# EAGLE design shiftregister (EAGLE 7.2.0)
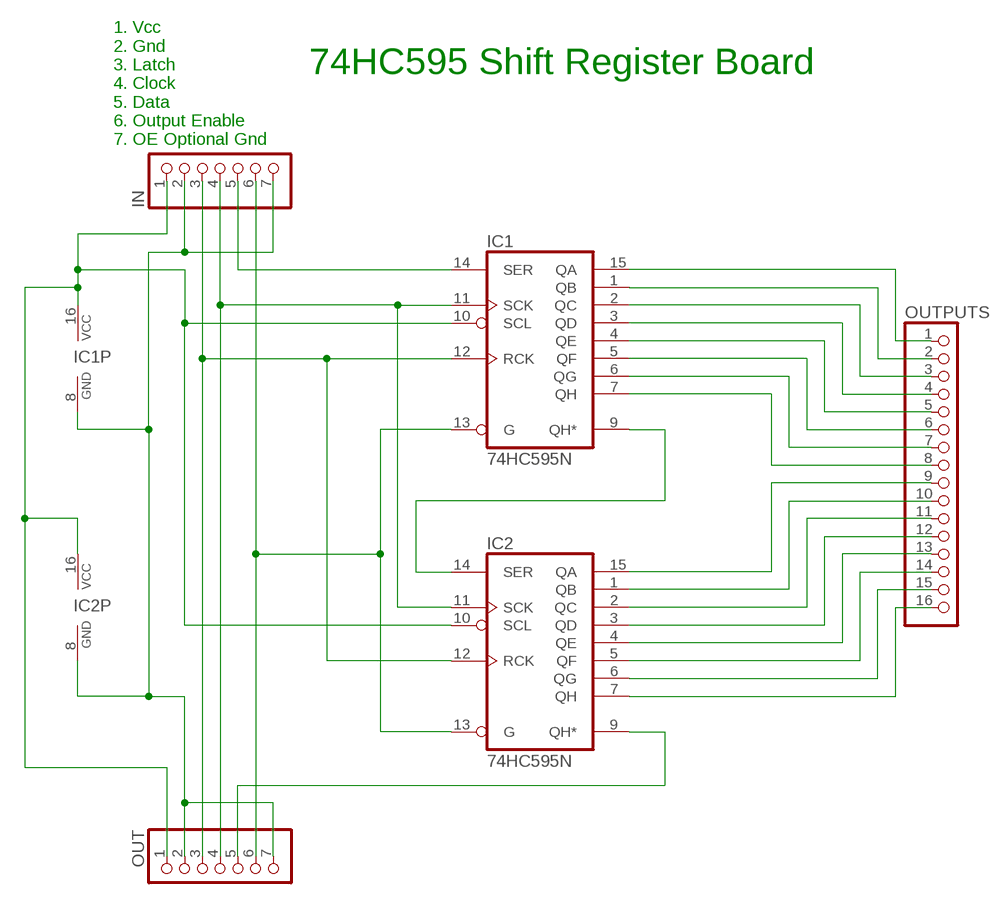
[diagram p0: schematic, sheet 1]

## Parts
IC1  74HC595N  [DIL16]
IC2  74HC595N  [DIL16]
IN  PINHD-1X7  [1X07]
OUT  PINHD-1X7  [1X07]
OUTPUTS  PINHD-1X16  [1X16]

## Nets
GND: IC1.8(GND) IC2.8(GND) IN.2 IN.7 OUT.2 OUT.7
N$1: IC1.15(QA) OUTPUTS.1
N$2: IC1.1(QB) OUTPUTS.2
N$3: IC1.2(QC) OUTPUTS.3
N$4: IC1.3(QD) OUTPUTS.4
N$5: IC1.4(QE) OUTPUTS.5
N$6: IC1.5(QF) OUTPUTS.6
N$7: IC1.6(QG) OUTPUTS.7
N$8: IC1.7(QH) OUTPUTS.8
N$9: IC1.9(QH*) IC2.14(SER)
N$11: IC1.14(SER) IN.5
N$12: IC2.9(QH*) OUT.5
N$13: IC1.13(G) IC2.13(G) IN.6 OUT.6
N$15: IC1.12(RCK) IC2.12(RCK) IN.3 OUT.3
N$16: IC1.11(SCK) IC2.11(SCK) IN.4 OUT.4
N$17: IC2.15(QA) OUTPUTS.9
N$18: IC2.1(QB) OUTPUTS.10
N$19: IC2.2(QC) OUTPUTS.11
N$20: IC2.3(QD) OUTPUTS.12
N$21: IC2.4(QE) OUTPUTS.13
N$22: IC2.5(QF) OUTPUTS.14
N$23: IC2.6(QG) OUTPUTS.15
N$24: IC2.7(QH) OUTPUTS.16
VCC: IC1.10(SCL) IC1.16(VCC) IC2.10(SCL) IC2.16(VCC) IN.1 OUT.1

## Notes on the sheet
- 74HC595 Shift Register Board
- 1. Vcc
  2. Gnd
  3. Latch
  4. Clock
  5. Data
  6. Output Enable
  7. OE Optional Gnd

## Library data of the parts
IC1 IC2 = 74xx-eu:74*595: 8-bit SHIFT REGISTER, output latch
IN OUT = pinhead:PINHD-1X7: PIN HEADER
OUTPUTS = pinhead:PINHD-1X16: PIN HEADER

## Board
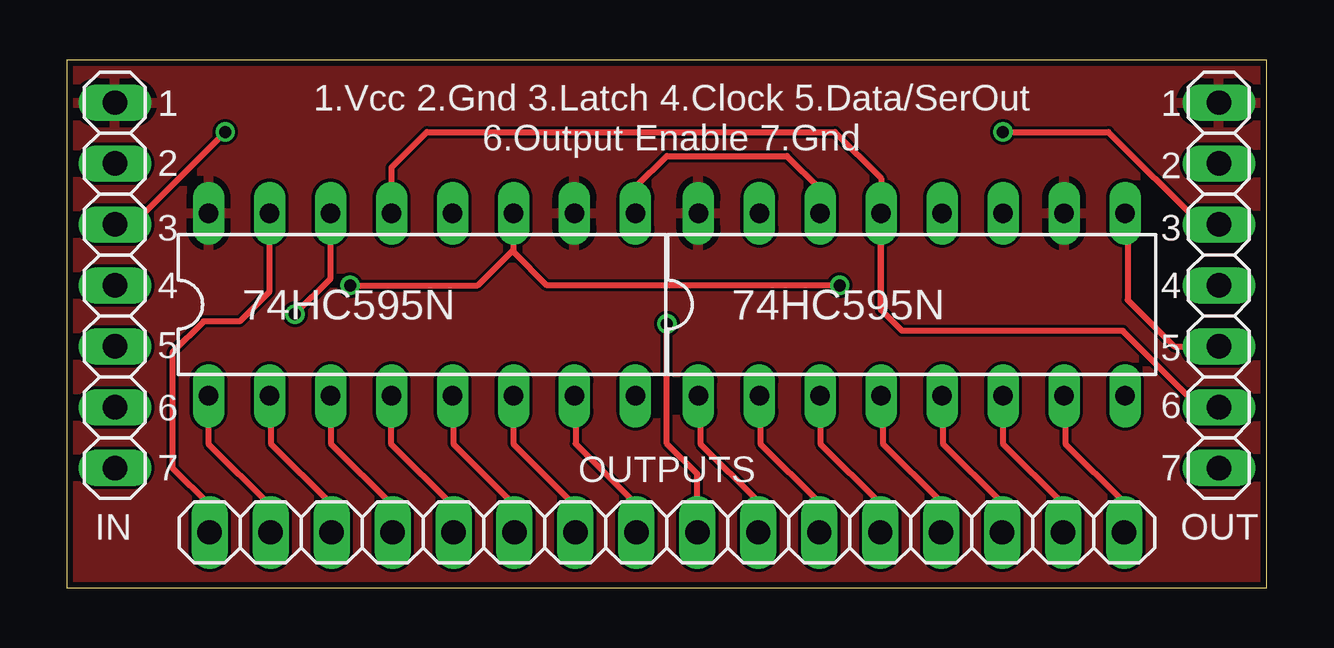
[diagram p1: board, top side]
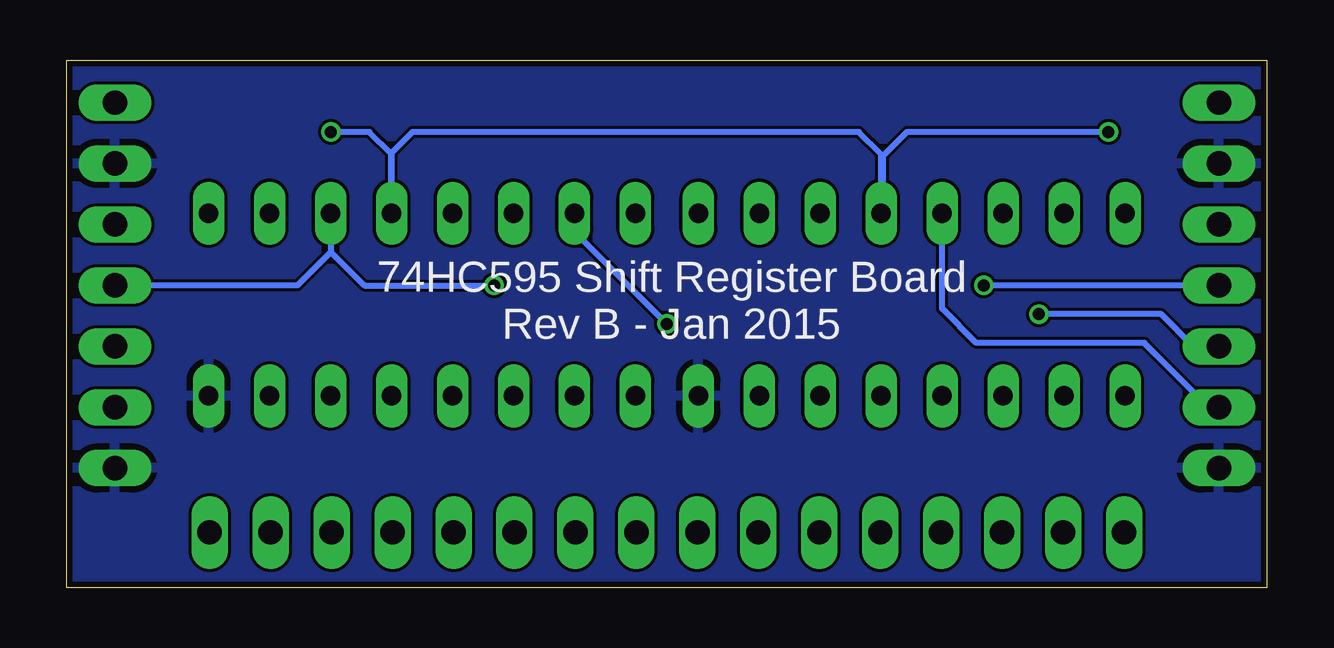
[diagram p2: board, bottom side, seen from below]

Size 50 x 22 mm. Coordinates in mm from the lower left corner, seen from the top.
Outline: 0,0 50,0 50,22 0,22 0,0
Copper layers (1*16): Top 0.035mm / dielectric 1.5mm / Bottom 0.035mm
Design rules "dirt_cheap_dirty_boards.v1": minimum track width 5mil, minimum drill 12mil, track to track 5mil, track to pad 5mil, pad to pad 5mil, via to via 5mil, smd to smd 0mil, copper to edge 10mil, drill to drill 10mil, minimum pad ring 10mil, minimum via ring 6mil, stop-mask expansion 2mil, vias tented up to drill 25mil, thermal gap 10mil

### Footprints (pad centres in the part's own frame; a part is rotated, then mirrored left to right if it is on the bottom)
DIL16 = drill 0.813 long: 1 -8.89,-3.81; 2 -6.35,-3.81; 3 -3.81,-3.81; 4 -1.27,-3.81; 5 1.27,-3.81; 6 3.81,-3.81; 7 6.35,-3.81; 8 8.89,-3.81; 9 8.89,3.81; 10 6.35,3.81; 11 3.81,3.81; 12 1.27,3.81; 13 -1.27,3.81; 14 -3.81,3.81; 15 -6.35,3.81; 16 -8.89,3.81
1X07 = drill 1.016 long: 1 -7.62,0; 2 -5.08,0; 3 -2.54,0; 4 0,0; 5 2.54,0; 6 5.08,0; 7 7.62,0
1X16 = drill 1.016 long: 1 -19.05,0; 2 -16.51,0; 3 -13.97,0; 4 -11.43,0; 5 -8.89,0; 6 -6.35,0; 7 -3.81,0; 8 -1.27,0; 9 1.27,0; 10 3.81,0; 11 6.35,0; 12 8.89,0; 13 11.43,0; 14 13.97,0; 15 16.51,0; 16 19.05,0

### Placement (x,y rotation side)
IC1  14.8,11.8 0 top
IC2  35.2,11.8 0 top
IN  2,12.6 270 top
OUT  48,12.6 270 top
OUTPUTS  25,2.3 0 top

### Tracks (layer width: path | path; a pad name or v marks a point on that pad's centre or on a via)
GND
  pour Bottom: 0,22 50,22 50,0 0,0
N$1
  Top 0.254: IC1.15 8.45,12.35 7.2,11.1 5.7,11.1 4.4,9.8 4.4,5 5.95,3.45 OUTPUTS.1
N$2
  Top 0.254: IC1.1 5.9,6 8.49,3.41 OUTPUTS.2
N$3
  Top 0.254: IC1.2 8.5,7.94 8.5,6 11.03,3.47 OUTPUTS.3
N$4
  Top 0.254: IC1.3 11,6 13.57,3.43 OUTPUTS.4
N$5
  Top 0.254: IC1.4 13.5,7.96 13.5,6 16.11,3.39 OUTPUTS.5
N$6
  Top 0.254: IC1.5 16.1,7.96 16.1,6 18.65,3.45 OUTPUTS.6
N$7
  Top 0.254: IC1.6 18.6,6 21.19,3.41 OUTPUTS.7
N$8
  Top 0.254: IC1.7 21.2,7.94 21.2,6 23.73,3.47 OUTPUTS.8
N$9
  Top 0.254: IC1.9 23.69,16.69 25,18 30,18 31.39,16.61 IC2.14
N$11  (via drill 0.5)
  Top 0.254: v9.5,11.4 10.99,12.89 IC1.14
  Bottom 0.254: IN.5 3.06,10.06 4.4,11.4 v9.5,11.4
N$12
  Top 0.254: IC2.9 44.2,15.5 44.2,12 46.14,10.06 OUT.5
N$13
  Top 0.254: OUT.6 47.98,7.5 47.2,7.5 44,10.7 34.8,10.7 33.93,11.57 IC2.13 | IC2.13 33.9,15.58 33.9,11.6 | IC1.13 13.53,17.53 15,19 32,19 33.93,17.07 IC2.13
  Bottom 0.254: IN.6 2.42,7.52 5.1,10.2 12.1,10.2 13.53,11.63 IC1.13
N$15  (via drill 0.5)
  Top 0.254: v39,19 43.4,19 47.26,15.14 OUT.3 | v6.6,19 2.74,15.14 IN.3
  Bottom 0.254: v39,19 37.4,19 36.47,18.07 IC2.12 36.5,15.64 36.5,18.1 35.6,19 17,19 16.07,18.07 IC1.12 16,15.68 16,18 15,19 v6.6,19
N$16  (via drill 0.5)
  Top 0.254: v32.2,12.6 20,12.6 18.61,13.99 18.61,14.1 | 18.61,14.1 IC1.11 | v11.8,12.6 17.11,12.6 18.61,14.1
  Bottom 0.254: IN.4 v11.8,12.6 | 39,14 IC2.11 39.01,14.01 39,14 | 39,14 40.4,12.6 OUT.4 | 39,14 37.6,12.6 v32.2,12.6
N$17  (via drill 0.5)
  Top 0.254: OUTPUTS.9 26.27,4.73 25,6 v25,11
  Bottom 0.254: v25,11 28.85,14.85 IC2.15
N$18
  Top 0.254: IC2.1 26.4,7.9 26.4,6 28.81,3.59 OUTPUTS.10
N$19
  Top 0.254: IC2.2 28.9,7.94 28.9,6 31.35,3.55 OUTPUTS.11
N$20
  Top 0.254: IC2.3 31.4,6 33.89,3.51 OUTPUTS.12
N$21
  Top 0.254: IC2.4 34,7.92 34,6 36.43,3.57 OUTPUTS.13
N$22
  Top 0.254: IC2.5 36.5,7.96 36.5,6 38.97,3.53 OUTPUTS.14
N$23
  Top 0.254: IC2.6 39,6 41.51,3.49 OUTPUTS.15
N$24
  Top 0.254: IC2.7 41.6,7.94 41.6,6 44.05,3.55 OUTPUTS.16
VCC
  pour Top: 0,22 50,22 50,0 0,0

### Text on the board
tPlace: 1 | 1.Vcc 2.Gnd 3.Latch 4.Clock 5.Data/SerOut / 6.Output Enable 7.Gnd | 1 | 2 | 2 | 3 | 3 | 4 | 4 | 5 | 5 | 6 | 6 | 7 | 7
bPlace: 74HC595 Shift Register Board / Rev B - Jan 2015